# Altium schematic sheet Slot_Detectors.SchDoc
size A
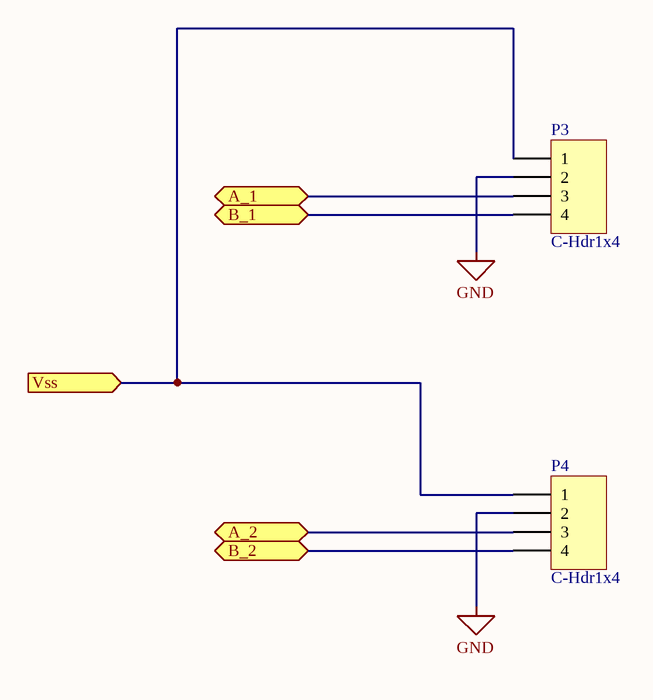
[diagram p0: Slot_Detectors.SchDoc]

## Parts
P3  C-Hdr1x4  [HDR1X4_LGE1.0]
P4  C-Hdr1x4  [HDR1X4_LGE1.0]

## Ports
A_1 (bidir), A_2 (bidir), B_1 (bidir), B_2 (bidir), Vss (in)

## Nets
GND: P3.2 P4.2
A_1: P3.3 ; port A_1
A_2: P4.3 ; port A_2
B_1: P3.4 ; port B_1
B_2: P4.4 ; port B_2
Vss: P3.1 P4.1 ; port Vss

## Library data of the parts
P3 P4 = C-Hdr1x4: Header, 4-Pin; LatestRevisionDate: 17-Jul-2002; LatestRevisionNote: Re-released for DXP Platform.; Publisher: Altium Limited